# EAGLE design esp32-driver (EAGLE 9.6.2)
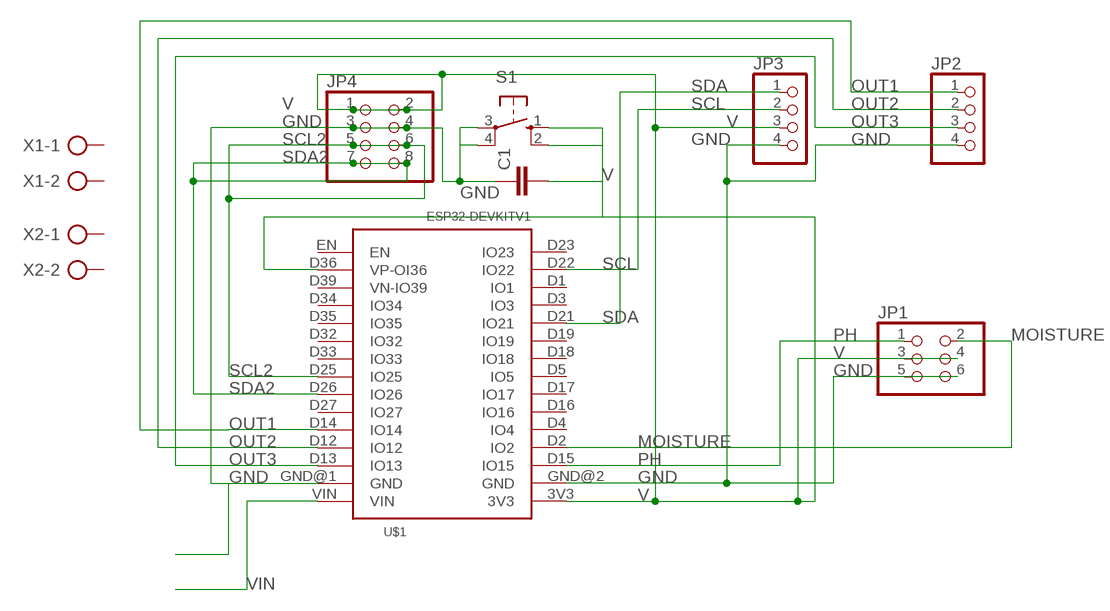
[diagram p0: schematic, sheet 1]

## Parts
C1  C-EU050-030X075  [C050-030X075]
JP1  PINHD-2X3  [2X03]
JP2  PINHD-1X4  [1X04]
JP3  PINHD-1X4  [1X04]
JP4  PINHD-2X4  [2X04]
S1  10-XX  [B3F-10XX]
U$1  ESP32DEVKITV1  [ESP32-DEVKITV1]
X1  AK300/2  [AK300/2]
X2  AK300/2  [AK300/2]

## Nets
GND: C1.1 JP1.5 JP1.6 JP2.4 JP3.4 JP4.3 JP4.4 S1.3(P) S1.4(P1) U$1.GND@1(GND) U$1.GND@2(GND)
MOISTURE: JP1.2 U$1.D2(IO2)
OUT1: JP2.1 U$1.D14(IO14)
OUT2: JP2.2 U$1.D12(IO12)
OUT3: JP2.3 U$1.D13(IO13)
PH: JP1.1 U$1.D15(IO15)
SCL: JP3.2 U$1.D22(IO22)
SCL2: JP4.5 JP4.6 U$1.D25(IO25)
SDA: JP3.1 U$1.D21(IO21)
SDA2: JP4.7 JP4.8 U$1.D26(IO26)
V: C1.2 JP1.3 JP1.4 JP3.3 JP4.1 JP4.2 S1.1(S) S1.2(S1) U$1.3V3 U$1.D36(VP-OI36)
VIN: U$1.VIN
Unconnected: U$1.D1(IO1) U$1.D3(IO3) U$1.D4(IO4) U$1.D5(IO5) U$1.D16(IO16) U$1.D17(IO17) U$1.D18(IO18) U$1.D19(IO19) U$1.D23(IO23) U$1.D27(IO27) U$1.D32(IO32) U$1.D33(IO33) U$1.D34(IO34) U$1.D35(IO35) U$1.D39(VN-IO39) U$1.EN X1.1 X1.2 X2.1 X2.2

## Library data of the parts
C1 = rcl:C-EU: CAPACITOR, European symbol; SPICEPREFIX: C
JP1 = pinhead:PINHD-2X3: PIN HEADER
JP2 JP3 = pinhead:PINHD-1X4: PIN HEADER
JP4 = pinhead:PINHD-2X4: PIN HEADER
S1 = switch-omron:10-XX: OMRON SWITCH; MPN: B3F-1000; OC_FARNELL: 176432; OC_NEWARK: 36M3542
U$1 = esp32-devkitv1:ESP32DEVKITV1
X1 X2 = con-ptr500:AK300/2: CONNECTOR; OC_FARNELL: unknown; OC_NEWARK: unknown

## Board
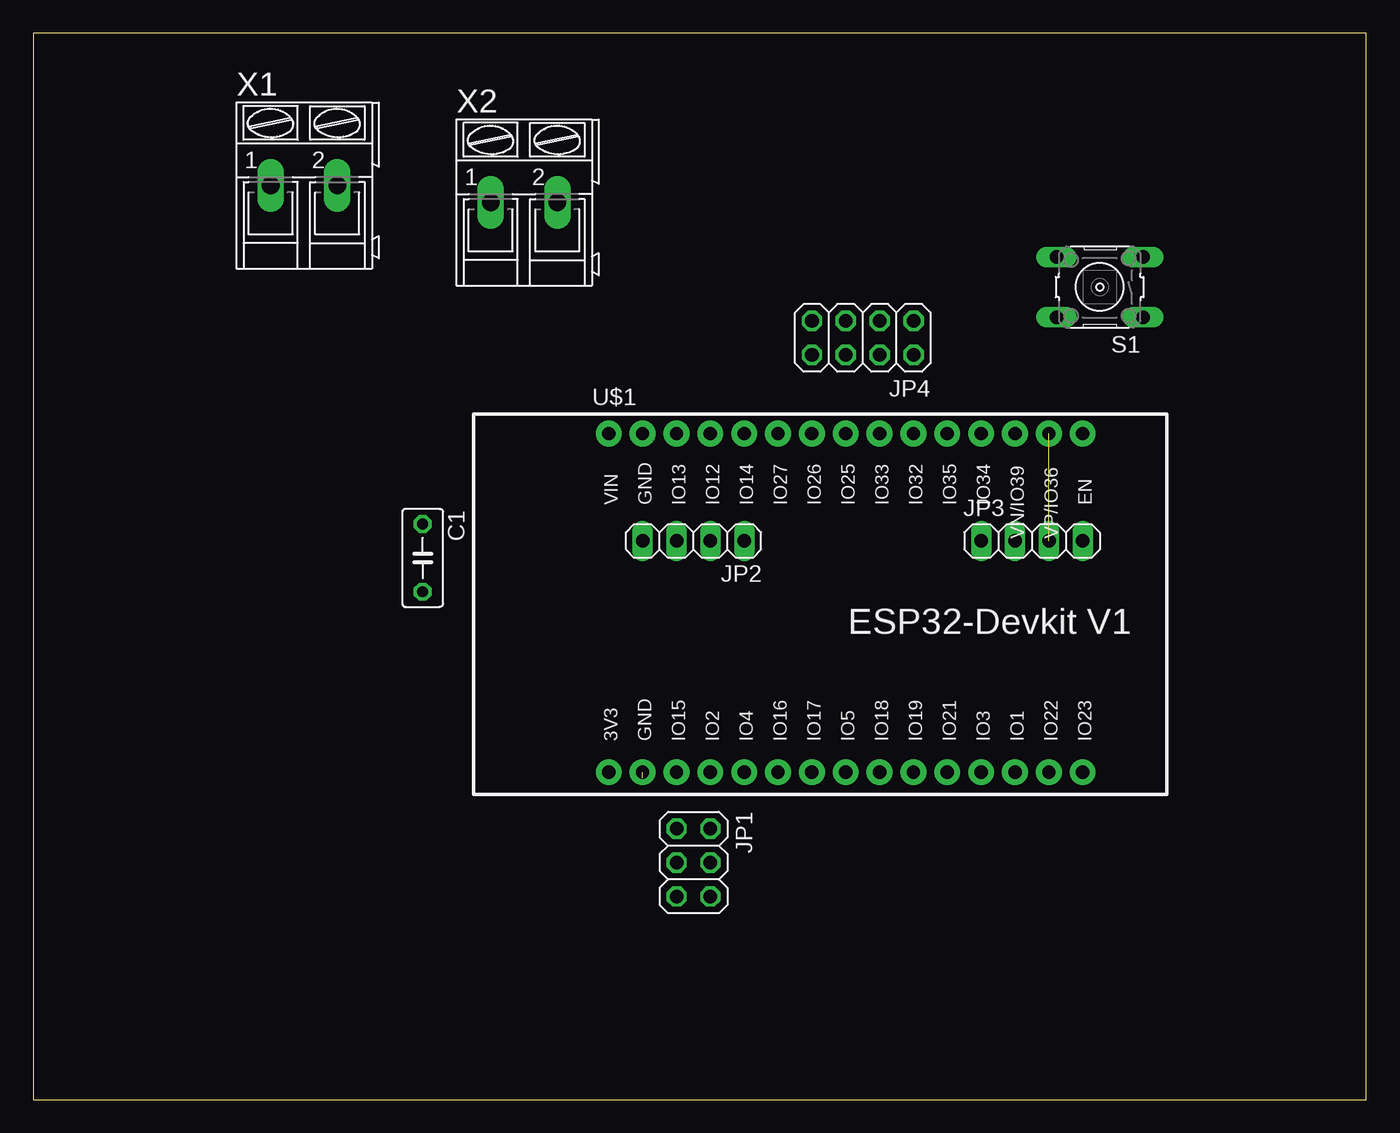
[diagram p1: board, top side]
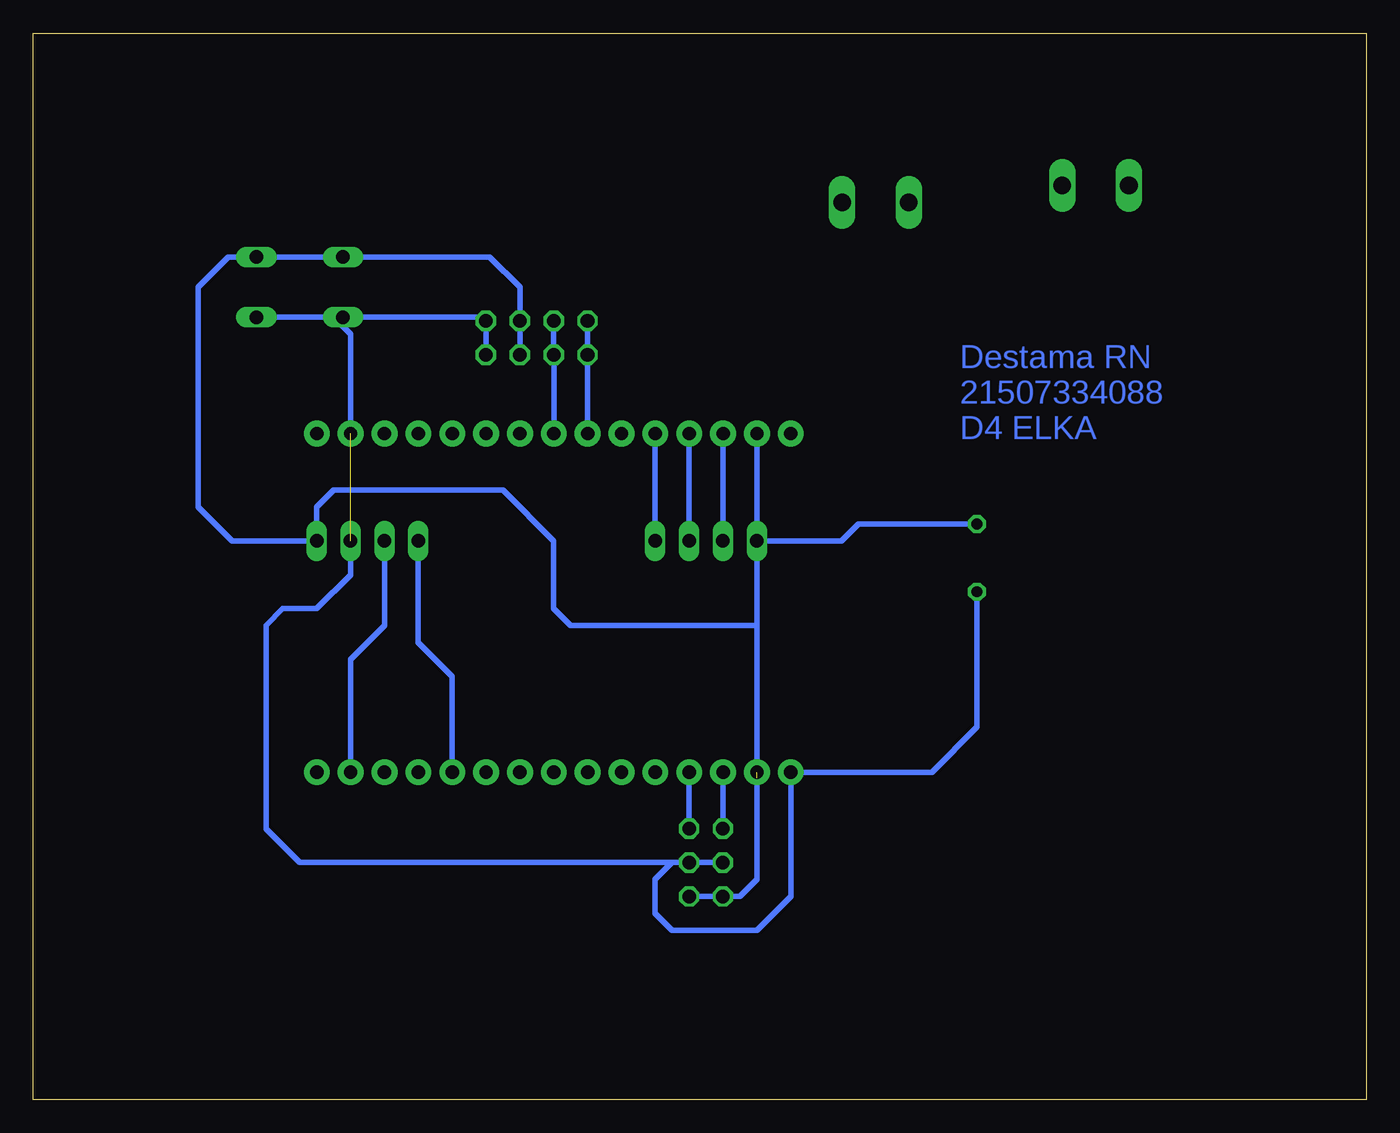
[diagram p2: board, bottom side, seen from below]

Size 100 x 80 mm. Coordinates in mm from the lower left corner, seen from the top.
Outline: 0,0 100,0 100,80 0,80 0,0
Copper layers (1*16): Top 0.035mm / dielectric 1.5mm / Bottom 0.035mm
Design rules "default": minimum track width 6mil, minimum drill 0.35mm, track to track 6mil, track to pad 6mil, pad to pad 6mil, via to via 6mil, smd to smd 6mil, copper to edge 40mil, drill to drill 6mil, minimum pad ring 10mil, minimum via ring 8mil, stop-mask expansion 4mil, vias tented up to drill 0mil, thermal gap 10mil

### Footprints (pad centres in the part's own frame; a part is rotated, then mirrored left to right if it is on the bottom)
C050-030X075 = drill 0.813 octagon: 1 -2.54,0; 2 2.54,0
2X03 = drill 1.016 octagon: 1 -2.54,-1.27; 2 -2.54,1.27; 3 0,-1.27; 4 0,1.27; 5 2.54,-1.27; 6 2.54,1.27
1X04 = drill 1.016 long: 1 -3.81,0; 2 -1.27,0; 3 1.27,0; 4 3.81,0
2X04 = drill 1.016 octagon: 1 -3.81,-1.27; 2 -3.81,1.27; 3 -1.27,-1.27; 4 -1.27,1.27; 5 1.27,-1.27; 6 1.27,1.27; 7 3.81,-1.27; 8 3.81,1.27
B3F-10XX = drill 1.016 long: 1 -3.251,2.261; 2 3.251,2.261; 3 -3.251,-2.261; 4 3.251,-2.261
ESP32-DEVKITV1 = drill 1 pad 1.93: 3V3 -16.52,-12.27; D1 13.96,-12.27; D2 -8.9,-12.27; D3 11.42,-12.27; D4 -6.36,-12.27; D5 1.26,-12.27; D12 -8.9,13.135; D13 -11.44,13.135; D14 -6.36,13.135; D15 -11.44,-12.27; D16 -3.82,-12.27; D17 -1.28,-12.27; D18 3.8,-12.27; D19 6.34,-12.27; D21 8.88,-12.27; D22 16.5,-12.27; D23 19.04,-12.27; D25 1.26,13.135; D26 -1.28,13.135; D27 -3.82,13.135; D32 6.34,13.135; D33 3.8,13.135; D34 11.42,13.135; D35 8.88,13.135; D36 16.5,13.135; D39 13.96,13.135; EN 19.04,13.135; GND@1 -13.98,13.135; GND@2 -13.98,-12.27; VIN -16.52,13.135
AK300/2 = drill 1.321 long: 1 -2.515,0; 2 2.489,0

### Placement (x,y rotation side)
C1  29.21,40.64 270 top
JP1  49.53,17.78 270 top
JP2  49.53,41.91 180 top
JP3  74.93,41.91 0 top
JP4  62.23,57.15 180 top
S1  80.01,60.96 180 top
U$1  59.69,36.83 0 top
X1  20.32,68.58 0 top
X2  36.83,67.31 0 top

### Tracks (layer width: path | path; a pad name or v marks a point on that pad's centre or on a via)
GND  (1 unrouted)
  Bottom 0.406: JP4.4 JP4.3 63.5,60.96 65.76,63.22 S1.4 77.47,63.22 S1.3 85.37,63.22 87.63,60.96 87.63,44.45 85.09,41.91 JP3.4 78.74,44.45 77.47,45.72 64.77,45.72 60.96,41.91 60.96,36.83 59.69,35.56 45.71,35.56 | JP1.6 JP1.5 46.99,15.24 45.72,16.51 45.72,24.13 | U$1.GND@1 JP2.4 | U$1.GND@2 45.71,35.56 | 45.71,35.56 JP2.4 | JP2.4 39.37,41.91 38.1,43.18 C1.1
MOISTURE
  Bottom 0.406: JP1.2 U$1.D2
OUT1
  Bottom 0.406: U$1.D14 JP2.1
OUT2
  Bottom 0.406: U$1.D12 JP2.2
OUT3
  Bottom 0.406: U$1.D13 JP2.3
PH
  Bottom 0.406: JP1.1 U$1.D15
SCL
  Bottom 0.406: U$1.D22 76.19,31.74 76.2,31.75 76.2,33.02 73.66,35.56 JP3.2
SCL2
  Bottom 0.406: U$1.D25 JP4.6 JP4.5
SDA
  Bottom 0.406: U$1.D21 68.57,31.74 71.12,34.29 JP3.1
SDA2
  Bottom 0.406: U$1.D26 JP4.8 JP4.7
V  (1 unrouted)
  Bottom 0.406: JP4.2 JP4.1 66.32,58.7 S1.2 77.47,58.7 | 77.47,58.7 S1.1 | U$1.D36 76.19,57.42 77.47,58.7 | JP1.3 JP1.4 | JP1.4 52.07,17.78 53.34,16.51 53.34,13.97 52.07,12.7 45.72,12.7 43.17,15.25 U$1.3V3 32.59,24.56 29.21,27.94 C1.2 | JP3.3 76.2,39.37 78.74,36.83 81.28,36.83 82.55,35.56 82.55,20.32 80.01,17.78 JP1.4

### Text on the board
Bottom: Destama RN / 21507334088 / D4 ELKA